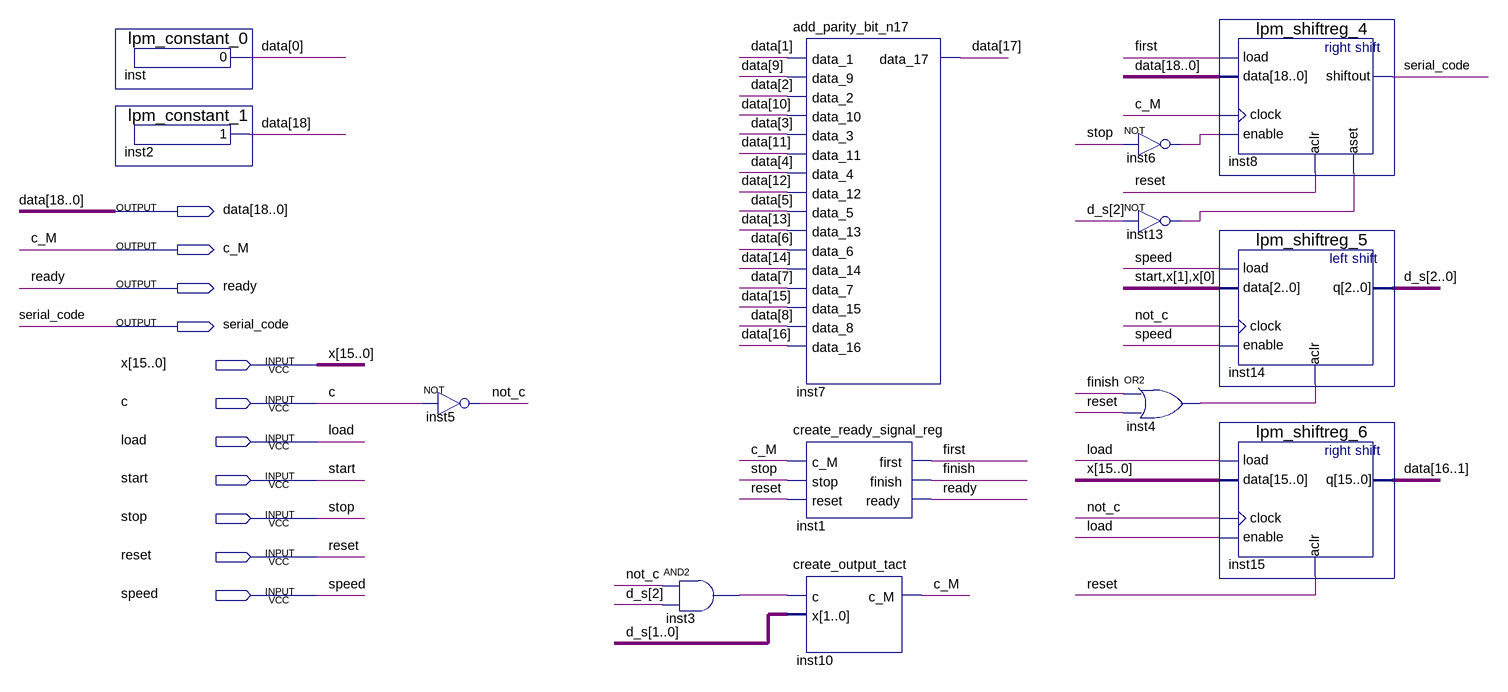
[diagram p0: schematic sheet]
// Quartus schematic create_serial_from_parallel_reg.bdf as structural Verilog: 13 symbols, 11 pins
module create_serial_from_parallel_reg (
  input  [15:0] x,
  input  c,
  input  load,
  input  start,
  input  stop,
  input  reset,
  input  speed,
  output [18:0] data,
  output c_M,
  output ready,
  output serial_code
);

  wire finish, first, inst3_out, inst4_out, inst6_out, inst13_out, not_c;
  wire [2:0] d_s;

  lpm_constant_0 inst (.result(data[0]));
  lpm_constant_1 inst2 (.result(data[18]));
  not inst5 (not_c, c);
  and inst3 (inst3_out, not_c, d_s[2]);
  add_parity_bit_n17 inst7 (
    .data_1(data[1]), .data_9(data[9]), .data_2(data[2]), .data_10(data[10]), .data_3(data[3]),
    .data_11(data[11]), .data_4(data[4]), .data_12(data[12]), .data_5(data[5]), .data_13(data[13]),
    .data_6(data[6]), .data_14(data[14]), .data_7(data[7]), .data_15(data[15]), .data_8(data[8]),
    .data_16(data[16]), .data_17(data[17]));
  create_ready_signal_reg inst1 (.c_M(c_M), .stop(stop), .reset(reset), .first(first), .finish(finish), .ready(ready));
  create_output_tact inst10 (.c(inst3_out), .x(d_s[1:0]), .c_M(c_M));
  not inst6 (inst6_out, stop);
  not inst13 (inst13_out, d_s[2]);
  or inst4 (inst4_out, finish, reset);
  lpm_shiftreg_4 inst8 (
    .load(first), .data(data), .clock(c_M), .enable(inst6_out), .aclr(reset), .aset(inst13_out),
    .shiftout(serial_code));
  lpm_shiftreg_5 inst14 (
    .load(speed), .data({start, x[1:0]}), .clock(not_c), .enable(speed), .aclr(inst4_out), .q(d_s));
  lpm_shiftreg_6 inst15 (.load(load), .data(x), .clock(not_c), .enable(load), .aclr(reset), .q(data[16:1]));
endmodule
